# Altium schematic sheet Sheet1.SchDoc
size A4
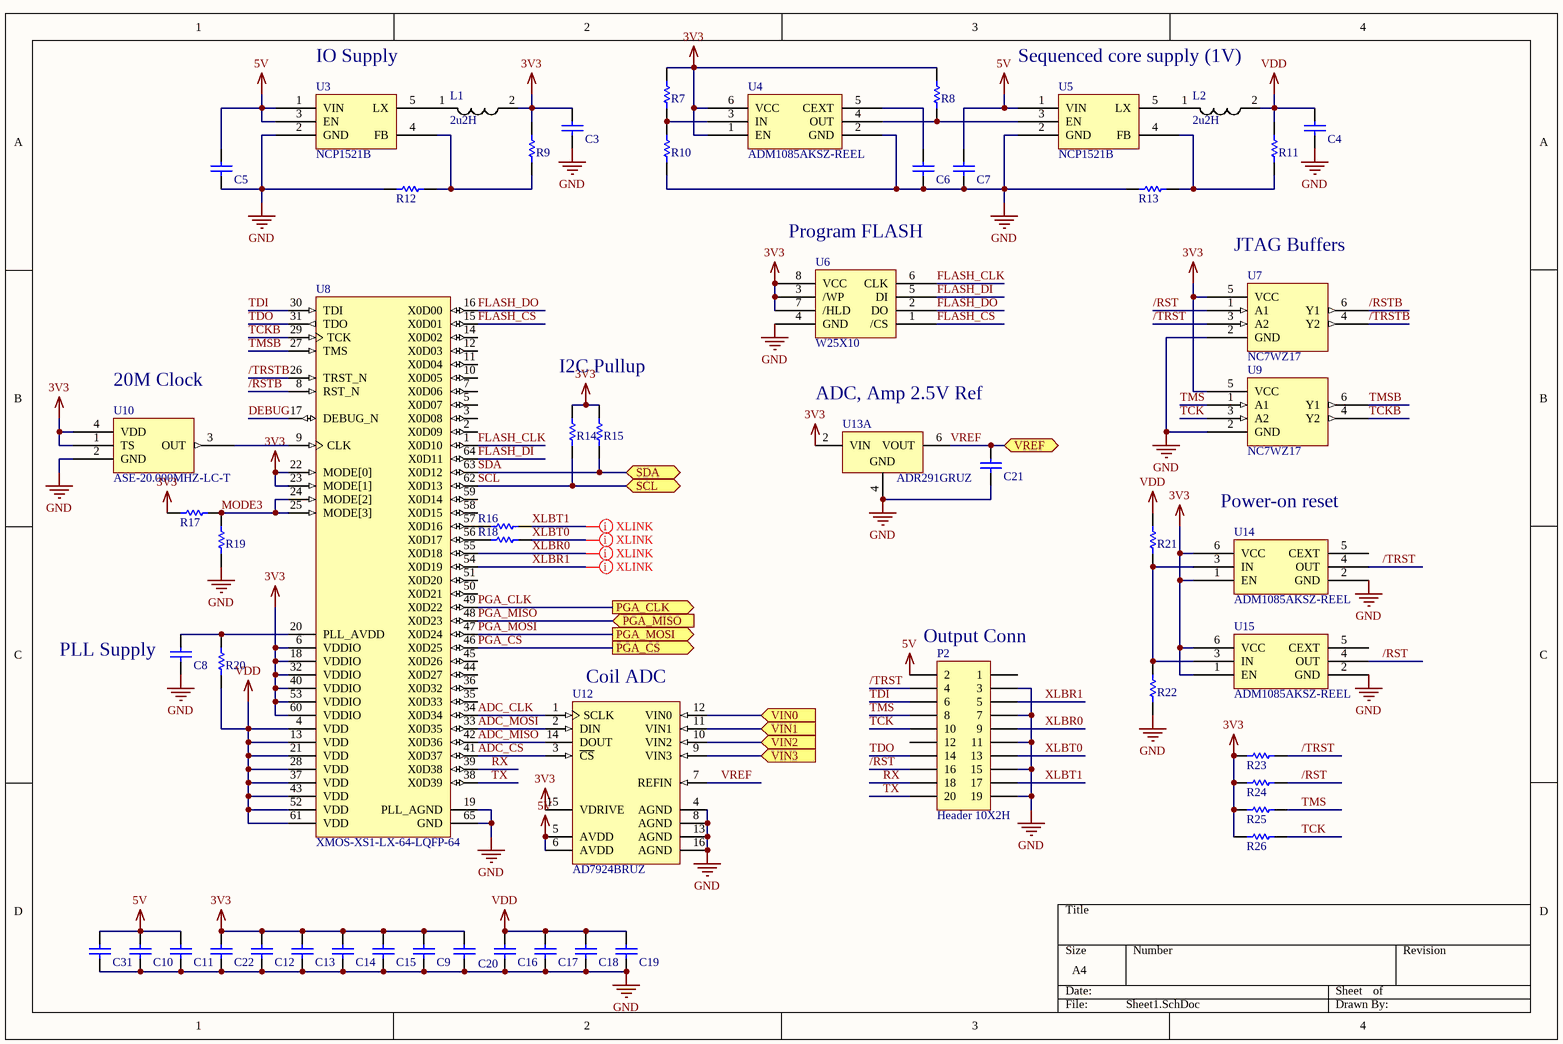
[diagram p0: Sheet1.SchDoc]

## Parts
C3  CAP 10uF 6.3V 0603(1608)  [CAPC0603(1608)100_N]  (value not drawn)
C4  CAP 10uF 6.3V 0603(1608)  [CAPC0603(1608)100_N]  (value not drawn)
C5  CAP 10uF 6.3V 0603(1608)  [CAPC0603(1608)100_N]  (value not drawn)
C6  CAP 10nF 10V 0402(1005)  [CAPC0402(1005)60_N]  (value not drawn)
C7  CAP 10uF 6.3V 0603(1608)  [CAPC0603(1608)100_N]  (value not drawn)
C8  CAP 1uF 16V 0402(1005)  [CAPC0402(1005)60_N]  (value not drawn)
C9  CAP 100nF 25V 0402(1005)  [CAPC0402(1005)60_N]  (value not drawn)
C10  CAP 100nF 25V 0402(1005)  [CAPC0402(1005)60_N]  (value not drawn)
C11  CAP 100nF 25V 0402(1005)  [CAPC0402(1005)60_N]  (value not drawn)
C12  CAP 1uF 16V 0402(1005)  [CAPC0402(1005)60_N]  (value not drawn)
C13  CAP 1uF 16V 0402(1005)  [CAPC0402(1005)60_N]  (value not drawn)
C14  CAP 100nF 25V 0402(1005)  [CAPC0402(1005)60_N]  (value not drawn)
C15  CAP 100nF 25V 0402(1005)  [CAPC0402(1005)60_N]  (value not drawn)
C16  CAP 100nF 25V 0402(1005)  [CAPC0402(1005)60_N]  (value not drawn)
C17  CAP 100nF 25V 0402(1005)  [CAPC0402(1005)60_N]  (value not drawn)
C18  CAP 1uF 16V 0402(1005)  [CAPC0402(1005)60_N]  (value not drawn)
C19  CAP 1uF 16V 0402(1005)  [CAPC0402(1005)60_N]  (value not drawn)
C20  CAP 100nF 25V 0402(1005)  [CAPC0402(1005)60_N]  (value not drawn)
C21  CAP 100nF 25V 0402(1005)  [CAPC0402(1005)60_N]  (value not drawn)
C22  CAP 1uF 16V 0402(1005)  [CAPC0402(1005)60_N]  (value not drawn)
C31  CAP 10uF 6.3V 0603(1608)  [CAPC0603(1608)100_N]  (value not drawn)
L1  2u2H  [2016 Inductor]
L2  2u2H  [2016 Inductor]
P2  Header 10X2H  [HDR2X10H]
R7  36K 1% 0402(1005)  [RESC0402(1005)_N]  (value not drawn)
R8  10K 1% 0402(1005)  [RESC0402(1005)_N]  (value not drawn)
R9  68K 1% 0402(1005)  [RESC0402(1005)_N]  (value not drawn)
R10  10K 1% 0402(1005)  [RESC0402(1005)_N]  (value not drawn)
R11  68K 1% 0402(1005)  [RESC0402(1005)_N]  (value not drawn)
R12  15K 5% 0402(1005)  [RESC0402(1005)_N]  (value not drawn)
R13  100K 1% 0402(1005)  [RESC0402(1005)_N]  (value not drawn)
R14  10K 1% 0402(1005)  [RESC0402(1005)_N]  (value not drawn)
R15  10K 1% 0402(1005)  [RESC0402(1005)_N]  (value not drawn)
R16  33R 5% 0402(1005)  [RESC0402(1005)_N]  (value not drawn)
R17  10K 1% 0402(1005)  [RESC0402(1005)_N]  (value not drawn)
R18  33R 5% 0402(1005)  [RESC0402(1005)_N]  (value not drawn)
R19  Jumper 0402(1005)  [RESC0402(1005)_N]  (value not drawn)
R20  4R7 5% 0402(1005)  [RESC0402(1005)_N]  (value not drawn)
R21  15K 1% 0402(1005)  [RESC0402(1005)_N]  (value not drawn)
R22  36K 1% 0402(1005)  [RESC0402(1005)_N]  (value not drawn)
R23  10K 1% 0402(1005)  [RESC0402(1005)_N]  (value not drawn)
R24  10K 1% 0402(1005)  [RESC0402(1005)_N]  (value not drawn)
R25  10K 1% 0402(1005)  [RESC0402(1005)_N]  (value not drawn)
R26  10K 1% 0402(1005)  [RESC0402(1005)_N]  (value not drawn)
U3  NCP1521B  [TSOP5]
U4  ADM1085AKSZ-REEL  [KS_6]
U5  NCP1521B  [TSOP5]
U6  W25X10  [SO8_N]
U7  NC7WZ17  [KS_6]
U8  XMOS-XS1-LX-64-LQFP-64  [XMOS-LQFP-64_V_MOD]
U9  NC7WZ17  [KS_6]
U10  ASE-20.000MHZ-LC-T  [4-SMD (3.2 x 2.5mm)]
U12  AD7924BRUZ  [RU-16_N]
U13  ADR291GRUZ  [ADI-RU-8_N]  (part A of 2)
U14  ADM1085AKSZ-REEL  [KS_6]
U15  ADM1085AKSZ-REEL  [KS_6]

## Ports
PGA_CLK (out), PGA_CS (out), PGA_MISO (in), PGA_MOSI (out), SCL (bidir), SDA (bidir), VIN0 (in), VIN1 (in), VIN2 (in), VIN3 (in), VREF

## Nets
3V3: C3.2 C9.2 C12.2 C13.2 C14.2 C15.2 C20.2 C22.2 L1.2 R7.2 R8.2 R9.2 R14.2 R15.2 R17.2 R23.2 R24.2 R25.2 R26.2 U4.1(EN) U4.6(VCC) U6.3(/WP) U6.7(/HLD) U6.8(VCC) U7.5(VCC) U8.6(VDDIO) U8.18(VDDIO) U8.22(MODE[0]) U8.23(MODE[1]) U8.32(VDDIO) U8.40(VDDIO) U8.53(VDDIO) U8.60(VDDIO) U9.5(VCC) U10.1(TS) U10.4(VDD) U12.15(VDRIVE) U13.2(VIN) U14.1(EN) U14.6(VCC) U15.1(EN) U15.6(VCC)
5V: C5.1 C7.1 C10.2 C11.2 C31.1 P2.2 U3.1(VIN) U3.3(EN) U5.1(VIN) U12.5(AVDD) U12.6(AVDD)
GND: C3.1 C4.1 C5.2 C6.1 C7.2 C8.2 C9.1 C10.1 C11.1 C12.1 C13.1 C14.1 C15.1 C16.1 C17.1 C18.1 C19.1 C20.1 C21.1 C22.1 C31.2 P2.3 P2.7 P2.11 P2.15 P2.19 R10.1 R12.1 R13.1 R19.1 R22.1 U3.2(GND) U4.2(GND) U5.2(GND) U6.4(GND) U7.2(GND) U8.19(PLL_AGND) U8.65(GND) U9.2(GND) U10.2(GND) U12.4(AGND) U12.8(AGND) U12.13(AGND) U12.16(AGND) U13.4(GND) U14.2(GND) U15.2(GND)
VDD: C4.2 C16.2 C17.2 C18.2 C19.2 L2.2 R11.2 R20.1 R21.2 U8.4(VDD) U8.13(VDD) U8.21(VDD) U8.28(VDD) U8.37(VDD) U8.43(VDD) U8.52(VDD) U8.61(VDD)
/RST: P2.16 R24.1 U7.1(A1) U15.4(OUT)
/RSTB: U7.6(Y1) U8.8(RST_N)
/TRST: P2.4 R23.1 U7.3(A2) U14.4(OUT)
/TRSTB: U7.4(Y2) U8.26(TRST_N)
ADC_CLK: U8.34(X0D34) U12.1(SCLK)
ADC_CS: U8.41(X0D37) U12.3(~{CS})
ADC_MISO: U8.42(X0D36) U12.14(DOUT)
ADC_MOSI: U8.33(X0D35) U12.2(DIN)
DEBUG: U8.17(DEBUG_N)
FLASH_CLK: U6.6(CLK) U8.1(X0D10)
FLASH_CS: U6.1(/CS) U8.15(X0D01)
FLASH_DI: U6.5(DI) U8.64(X0D11)
FLASH_DO: U6.2(DO) U8.16(X0D00)
MODE3: R17.1 R19.2 U8.24(MODE[2]) U8.25(MODE[3])
PGA_CLK: U8.49(X0D22) ; port PGA_CLK
PGA_CS: U8.46(X0D25) ; port PGA_CS
PGA_MISO: U8.48(X0D23) ; port PGA_MISO
PGA_MOSI: U8.47(X0D24) ; port PGA_MOSI
RX: P2.18 U8.39(X0D38)
SCL: R14.1 U8.62(X0D13) ; port SCL
SDA: R15.1 U8.63(X0D12) ; port SDA
TCK: P2.10 R26.1 U9.3(A2)
TCKB: U8.29(TCK) U9.4(Y2)
TDI: P2.6 U8.30(TDI)
TDO: P2.14 U8.31(TDO)
TMS: P2.8 R25.1 U9.1(A1)
TMSB: U8.27(TMS) U9.6(Y1)
TX: P2.20 U8.38(X0D39)
VIN0: U12.12(VIN0) ; port VIN0
VIN1: U12.11(VIN1) ; port VIN1
VIN2: U12.10(VIN2) ; port VIN2
VIN3: U12.9(VIN3) ; port VIN3
VREF: C21.2 U12.7(REFIN) U13.6(VOUT) ; port VREF
XLBR0: P2.9 U8.55(X0D18)
XLBR1: P2.5 U8.54(X0D19)
XLBT0: P2.13 R18.2
XLBT1: P2.17 R16.2
NetC6_2: C6.2 U4.5(CEXT)
NetC8_1: C8.1 R20.2 U8.20(PLL_AVDD)
NetL1_1: L1.1 U3.5(LX)
NetL2_1: L2.1 U5.5(LX)
NetR7_1: R7.1 R10.2 U4.3(IN)
NetR8_1: R8.1 U4.4(OUT) U5.3(EN)
NetR9_1: R9.1 R12.2 U3.4(FB)
NetR11_1: R11.1 R13.2 U5.4(FB)
NetR16_1: R16.1 U8.57(X0D16)
NetR18_1: R18.1 U8.56(X0D17)
NetR21_1: R21.1 R22.2 U14.3(IN) U15.3(IN)
NetU8_9: U8.9(CLK) U10.3(OUT)

Not connected (* = marked no-connect by the designer): P2 1 12; U8 2(X0D09) 3(X0D08) 5(X0D07) 7(X0D06) 10(X0D05) 11(X0D04) 12(X0D03) 14(X0D02) 35(X0D33) 36(X0D32) 44(X0D27) 45(X0D26) 50(X0D21) 51(X0D20) 58(X0D15) 59(X0D14); U14 5(CEXT); U15 5(CEXT)

## Layout directives
net class XLB: XLBR0, XLBR1, XLBT0, XLBT1

## Notes on the sheet
- IO Supply
- Sequenced core supply (1V)
- Program FLASH
- (near U7) JTAG Buffers
- (near U10) 20M Clock
- I2C Pullup
- ADC, Amp 2.5V Ref
- Power-on reset
- (near C8) PLL Supply
- (near P2) Output Conn
- (near U12) Coil ADC

## Library data of the parts
C3-C5 C7 C31 = CMP-1035-02797-1: CAP 10uF 6.3V ±20% 0603 (1608 Metric) Thickness 1mm SMD; Case-Metric: 1608; Case-EIA: 0603; Value: 10uF; Technology: SMT; Tolerance: ±20%; Max Thickness: 1 mm; Rated Voltage: 6.3 V
C6 = CMP-1034-01870-1: CAP 10nF 10V ±5% 0402 (1005 Metric) Thickness 0.6mm SMD; Case-EIA: 0402; Case-Metric: 1005; Value: 10nF; Technology: SMT; Max Thickness: 0.6 mm; Tolerance: ±5%; Rated Voltage: 10 V
C8 C12 C13 C18 C19 C22 = CMP-1034-02120-1: CAP 1uF 16V ±20% 0402 (1005 Metric) Thickness 0.6mm SMD; Case-EIA: 0402; Case-Metric: 1005; Rated Voltage: 16 V; Tolerance: ±20%; Value: 1uF; Technology: SMT; Max Thickness: 0.6 mm
C9-C11 C14-C17 C20 C21 = CMP-1034-02073-1: CAP 100nF 25V ±20% 0402 (1005 Metric) Thickness 0.6mm SMD; Case-EIA: 0402; Case-Metric: 1005; Rated Voltage: 25 V; Value: 100nF; Tolerance: ±20%; Max Thickness: 0.6 mm; Technology: SMT
L1 L2 = 2016 Inductor
P2 = Header 10X2H: Header, 10-Pin, Dual row, Right Angle; LatestRevisionDate: 17-Jul-2002; LatestRevisionNote: Re-released for DXP Platform.; Publisher: Altium Limited
R7 R22 = CMP-1011-00685-1: 36K 0.063W 1% 0402 (1005 Metric)  SMD; Value: 36000.00 Ohm; Case-EIA: 0402; Case-Metric: 1005; Power: 0.063 W; Tolerance: 1 %; Technology: SMT
R8 R10 R14 R15 R17 R23-R26 = CMP-1011-00623-1: 10K 0.063W 1% 0402 (1005 Metric)  SMD; Case-Metric: 1005; Value: 10000.00 Ohm; Case-EIA: 0402; Tolerance: 1 %; Technology: SMT; Power: 0.063 W
R9 R11 = CMP-1011-00717-1: 68K 0.063W 1% 0402 (1005 Metric)  SMD; Value: 68000.00 Ohm; Case-EIA: 0402; Case-Metric: 1005; Tolerance: 1 %; Power: 0.063 W; Technology: SMT
R12 = CMP-1011-00102-1: 15K 0.063W 5% 0402 (1005 Metric)  SMD; Value: 15000.00 Ohm; Case-Metric: 1005; Case-EIA: 0402; Tolerance: 5 %; Technology: SMT; Power: 0.063 W
R13 = CMP-1011-00736-1: 100K 0.063W 1% 0402 (1005 Metric)  SMD; Value: 100000.00 Ohm; Case-EIA: 0402; Case-Metric: 1005; Power: 0.063 W; Tolerance: 1 %; Technology: SMT
R16 R18 = CMP-1011-00038-1: 33R 0.063W 5% 0402 (1005 Metric)  SMD; Case-EIA: 0402; Case-Metric: 1005; Value: 33.00 Ohm; Technology: SMT; Tolerance: 5 %; Power: 0.063 W
R19 = CMP-1011-00001-1: Jumper 0402 (1005 Metric); Tolerance: None; Case-Metric: 1005; Case-EIA: 0402; Value: 0.00 Ohm; Power: None; Technology: SMT
R20 = CMP-1011-00018-1: 4R7 0.063W 5% 0402 (1005 Metric)  SMD; Value: 4.70 Ohm; Case-EIA: 0402; Case-Metric: 1005; Power: 0.063 W; Technology: SMT; Tolerance: 5 %
R21 = CMP-1011-00641-1: 15K 0.063W 1% 0402 (1005 Metric)  SMD; Case-Metric: 1005; Value: 15000.00 Ohm; Case-EIA: 0402; Technology: SMT; Power: 0.063 W; Tolerance: 1 %
U4 U14 U15 = ADM1085AKSZ-REEL: Imported; RefDes: RefDes; Type: DEV; Value: Value; HelpURL: http://www.analog.com/static/imported-files/data_sheets/ADM1085_1086_1087_1088.pdf
U12 = CMP-0313-02203-2: Quad 12-Bit Analog-to-Digital Converter with Serial, SPI Interface and Sequencer, 1MSPS, 0 to +70 degC, RU-16, Pb-Free, Tube; Manufacturer: Analog Devices; Generic Part Number: AD7924; Resolution (Bits): 12; Automotive Qualified: Yes; Channels: 4; Interface: Ser, SPI; Throughput Rate (SPS): 1M; PackageReference: RU-16; ComponentLink1Description: Manufacturer URL; Mounting Technology: Surface Mount; ComponentLink1URL: http://www.analog.com/en/index.html; PackageDescription: 16-Lead Thin Shrink Small Outline Package [TSSOP]; PartNumber: AD7924BRUZ; ComponentLink4Description: Product URL; ComponentLink2Description: Datasheet; PackageVersion: Nov-2002; Packing: Tube; ComponentLink2URL: http://www.analog.com/static/imported-files/data_sheets/AD7904_7914_7924.pdf; ComponentLink4URL: http://www.analog.com/en/analog-to-digital-converters/ad-converters/ad7924/products/product.html; Code_JEDEC: MO-153-AB; RoHS: Y; ComponentLink3URL: http://www.analog.com/static/imported-files/packages/36244347913743854010197452789RU16.pdf; ComponentLink3Description: Package Specification; DatasheetVersion: Rev.B
U13 = CMP-0784-00483-1: Low Noise Micropower Precision Voltage Reference, 2.5 V Output, 2.8 to 15 V Supply, Industrial, 8-pin SOP (RU-8), Tube; Manufacturer: Analog Devices; Min V Supply (V): 2.8; Ref Out TC (ppm/C): 10; Vout: 2.5V; Max V Supply (V): 15; Automotive Qualified: Yes; PartNumber: ADR291GRUZ; ComponentLink4Description: URL Link1; Operating Temp Range: -40 to 125 degC; ComponentLink2Description: Datasheet; Mounting Technology: Surface Mount; Code_JEDEC: MO-153AA; ComponentLink2URL: http://www.analog.com/static/imported-files/data_sheets/ADR291_292.pdf; Packing: Tube; ComponentLink3URL: http://www.analog.com/static/imported-files/packages/359224089841708504863856053953356548880RU08.pdf; PackageDescription: 8-Pin Thin Shrink Small Outline Package, Body 3 x 4.4 mm, Pitch 0.65 mm; ComponentLink1Description: Manufacturer URL; PackageReference: RU-8; ComponentLink4URL: Product URL:http://www.analog.com/en/special-linear-functions/voltage-references/adr291/products/product.html; ComponentLink3Description: Package Specification; PackageVersion: Jan-03; DatasheetVersion: Rev. F; ComponentLink1URL: http://www.analog.com/en/index.html
U3 U5 = NCP1521B: Supplier 1: Digi-Key; Supplier 2: Mouser; Supplier Part Number 1: NCP1521BSNT1GOSTR-ND; Supplier Part Number 2: 863-NCP1521BSNT1G
U6 = W25X10: Supplier 1: Digi-Key; Supplier Part Number 1: W25X10CLSNIG-ND
U7 U9 = NC7WZ17: HelpURL: https://www.fairchildsemi.com/ds/NC/NC7WZ17.pdf
U10 = ASE-20.000MHZ-LC-T: ComponentLink1URL: http://www.abracon.com/Oscillators/ASEseries.pdf; ComponentLink1Description: Datasheet; Frequency: 20.000MHZ